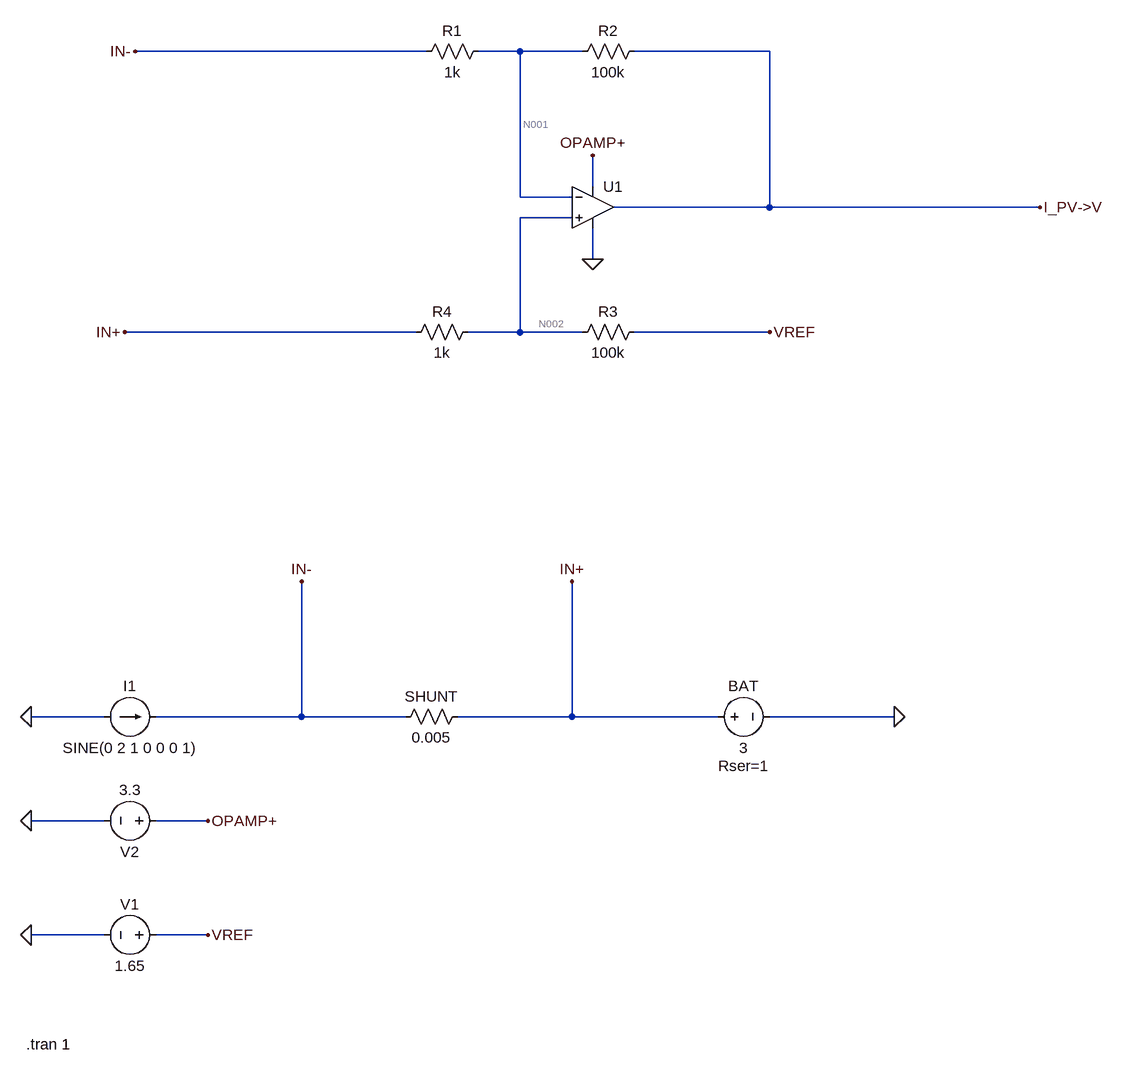
[diagram p0: schematic Current Sensing Block V1 (bat).asc]
Current Sensing Block V1 (bat).asc, the LTspice schematic file:
Version 4
SHEET 1 1476 1544
WIRE 32 0 -416 0
WIRE 176 0 112 0
WIRE 272 0 176 0
WIRE 560 0 352 0
WIRE 288 208 288 160
WIRE 176 224 176 0
WIRE 256 224 176 224
WIRE 560 240 560 0
WIRE 560 240 320 240
WIRE 976 240 560 240
WIRE 256 256 176 256
WIRE 288 320 288 272
WIRE 16 432 -432 432
WIRE 176 432 176 256
WIRE 176 432 96 432
WIRE 272 432 176 432
WIRE 560 432 352 432
WIRE -464 1024 -576 1024
WIRE -160 1024 -160 816
WIRE -160 1024 -384 1024
WIRE 0 1024 -160 1024
WIRE 256 1024 256 816
WIRE 256 1024 80 1024
WIRE 480 1024 256 1024
WIRE 752 1024 560 1024
WIRE -464 1184 -576 1184
WIRE -304 1184 -384 1184
WIRE -464 1360 -576 1360
WIRE -304 1360 -384 1360
FLAG -576 1024 0
FLAG 752 1024 0
FLAG 288 320 0
FLAG 288 160 OPAMP+
FLAG -576 1184 0
FLAG -304 1184 OPAMP+
FLAG -160 816 IN-
FLAG 256 816 IN+
FLAG -416 0 IN-
FLAG -432 432 IN+
FLAG 560 432 VREF
FLAG -576 1360 0
FLAG -304 1360 VREF
FLAG 976 240 I_PV->V
SYMBOL res 128 -16 R90
WINDOW 0 0 56 VBottom 2
WINDOW 3 32 56 VTop 2
SYMATTR InstName R1
SYMATTR Value 1k
SYMBOL res 368 -16 R90
WINDOW 0 0 56 VBottom 2
WINDOW 3 32 56 VTop 2
SYMATTR InstName R2
SYMATTR Value 100k
SYMBOL res 368 416 R90
WINDOW 0 0 56 VBottom 2
WINDOW 3 32 56 VTop 2
SYMATTR InstName R3
SYMATTR Value 100k
SYMBOL res 112 416 R90
WINDOW 0 0 56 VBottom 2
WINDOW 3 32 56 VTop 2
SYMATTR InstName R4
SYMATTR Value 1k
SYMBOL res -16 1040 R270
WINDOW 0 32 56 VTop 2
WINDOW 3 0 56 VBottom 2
SYMATTR InstName SHUNT
SYMATTR Value 0.005
SYMBOL current -464 1024 R270
WINDOW 0 32 40 VTop 2
WINDOW 3 -32 40 VBottom 2
WINDOW 123 0 0 Left 0
WINDOW 39 0 0 Left 0
SYMATTR InstName I1
SYMATTR Value SINE(0 2 1 0 0 0 1)
SYMBOL voltage -368 1184 R90
WINDOW 0 32 56 VTop 2
WINDOW 3 -32 56 VBottom 2
WINDOW 123 0 0 Left 0
WINDOW 39 0 0 Left 0
SYMATTR InstName V2
SYMATTR Value 3.3
SYMBOL voltage 464 1024 R270
WINDOW 0 32 56 VTop 2
WINDOW 3 -32 56 VBottom 2
WINDOW 123 0 0 Left 0
WINDOW 39 -60 56 VBottom 2
SYMATTR InstName BAT
SYMATTR Value 3
SYMATTR SpiceLine Rser=1
SYMBOL voltage -368 1360 R90
WINDOW 0 -32 56 VBottom 2
WINDOW 3 32 56 VTop 2
WINDOW 123 0 0 Left 0
WINDOW 39 0 0 Left 0
SYMATTR InstName V1
SYMATTR Value 1.65
SYMBOL OpAmps\\UniversalOpAmp2 288 240 R0
SYMATTR InstName U1
TEXT -584 1528 Left 2 !.tran 1

The netlist it stands for:
* Current Sensing Block V1 (bat).asc
R1 N001 IN- 1k
R2 I_PV->V N001 100k
R3 VREF N002 100k
R4 N002 IN+ 1k
R§SHUNT IN- IN+ 0.005
I1 0 IN- SINE(0 2 1 0 0 0 1)
V2 OPAMP+ 0 3.3
V§BAT IN+ 0 3 Rser=1
V1 VREF 0 1.65
XU1 N002 N001 OPAMP+ 0 I_PV->V level2 Avol=1Meg GBW=10Meg Slew=10Meg Ilimit=25m Rail=0 Vos=0 En=0 Enk=0 In=0 Ink=0 Rin=500Meg  ; pins In+ In- V+ V- OUT
.tran 1
.lib UniversalOpAmp2.lib
.backanno
.end

* Results of the author's LTspice run, read from the files saved beside the schematic
* Operating Point, zero values left out:
*   V(n001) = 2.987 V
*   V(in-) = 3 V
*   V(i_pv->v) = 1.65 V
*   V(vref) = 1.65 V
*   V(n002) = 2.987 V
*   V(in+) = 3 V
*   V(opamp+) = 3.3 V
*   I(Shunt) = -13.37 µA
*   I(R4) = -13.37 µA
*   I(R3) = -13.37 µA
*   I(R2) = -13.37 µA
*   I(R1) = -13.37 µA
*   I(V1) = 13.37 µA
*   I(Bat) = -26.74 µA
*   I(V2) = -158.5 µA
*   Ix(u1:1) = 2.673 nA
*   Ix(u1:2) = 2.673 nA
*   Ix(u1:3) = 158.5 µA
*   Ix(u1:4) = -171.8 µA
*   Ix(u1:5) = 13.37 µA
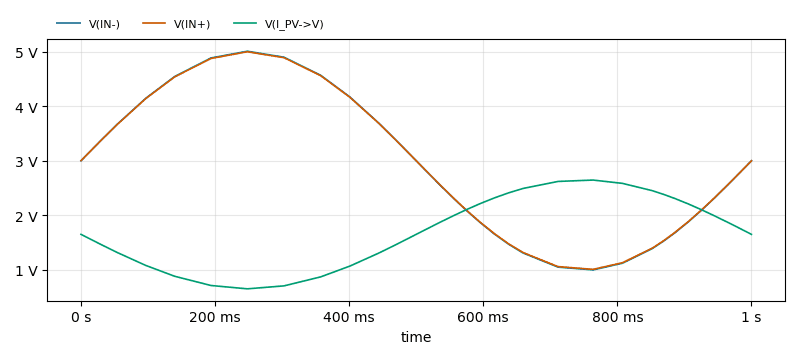
[diagram p1: Transient Analysis of Current Sensing Block V1 (bat).asc, plotted from the saved traces]
* Transient Analysis, 1 run:
*   V(IN-): min 997.5 mV, max 5.01 V, average 2.998 V, rms 3.315 V, last 3 V
*   V(IN+): min 1.007 V, max 5 V, average 2.998 V, rms 3.312 V, last 3 V
*   V(I_PV->V): min 650.2 mV, max 2.646 V, average 1.651 V, rms 1.795 V, last 1.65 V